# Altium schematic sheet Sheet1.SchDoc
size A4; SheetNumber: 1; SheetTotal: 1
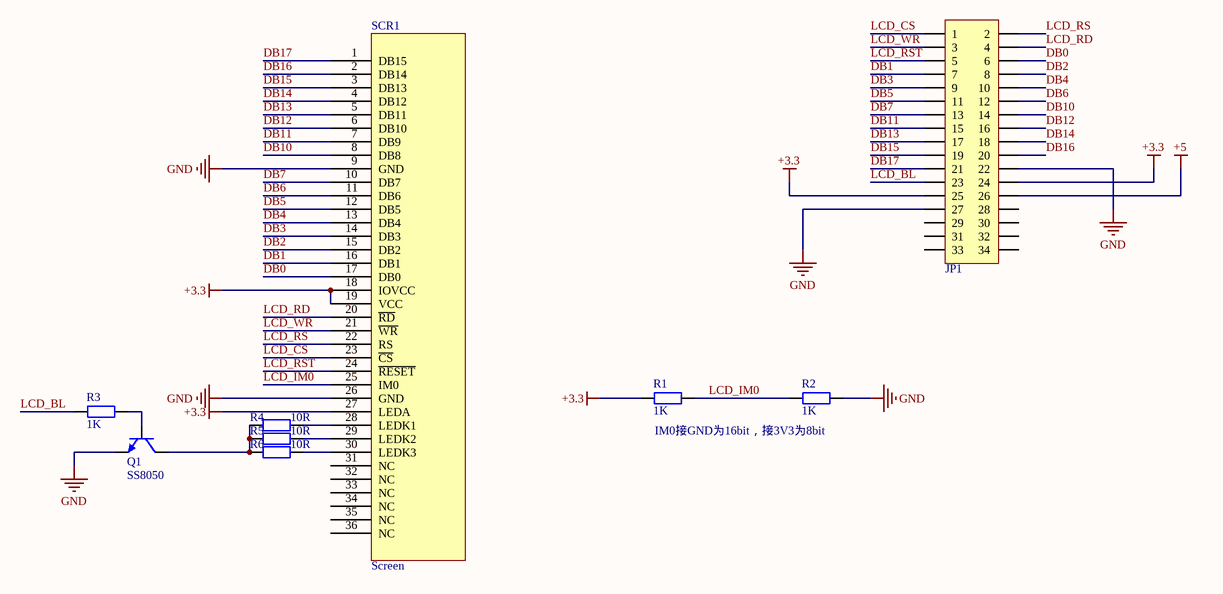
[diagram p0: Sheet1.SchDoc]

## Parts
JP1  Header 2X11  [HDR2.54-LI-2x17P]  (value not drawn)
Q1  SS8050  [SOT23-3N]
R1  1K  [R 0603_L]
R2  1K  [R 0603_L]
R3  1K  [R 0603_L]
R4  10R  [R 0603_L]
R5  10R  [R 0603_L]
R6  10R  [R 0603_L]
SCR1  Screen  [2.0inLCD]

## Nets
+3.3: JP1.24 JP1.25 R1.1 SCR1.18(IOVCC) SCR1.19(VCC) SCR1.27(LEDA)
+5: JP1.26
GND: JP1.22 JP1.27 Q1.2(E) R2.2 SCR1.9(GND) SCR1.26(GND)
DB0: JP1.6 SCR1.17(DB0)
DB1: JP1.7 SCR1.16(DB1)
DB2: JP1.8 SCR1.15(DB2)
DB3: JP1.9 SCR1.14(DB3)
DB4: JP1.10 SCR1.13(DB4)
DB5: JP1.11 SCR1.12(DB5)
DB6: JP1.12 SCR1.11(DB6)
DB7: JP1.13 SCR1.10(DB7)
DB10: JP1.14 SCR1.8(DB8)
DB11: JP1.15 SCR1.7(DB9)
DB12: JP1.16 SCR1.6(DB10)
DB13: JP1.17 SCR1.5(DB11)
DB14: JP1.18 SCR1.4(DB12)
DB15: JP1.19 SCR1.3(DB13)
DB16: JP1.20 SCR1.2(DB14)
DB17: JP1.21 SCR1.1(DB15)
LCD_BL: JP1.23 R3.1
LCD_CS: JP1.1 SCR1.23(~{CS})
LCD_IM0: R1.2 R2.1 SCR1.25(IM0)
LCD_RD: JP1.4 SCR1.20(~{RD})
LCD_RS: JP1.2 SCR1.22(RS)
LCD_RST: JP1.5 SCR1.24(~{RESET})
LCD_WR: JP1.3 SCR1.21(~{WR})
NetQ1_1: Q1.1(B) R3.2
NetQ1_3: Q1.3(C) R4.1 R5.1 R6.1
NetR4_2: R4.2 SCR1.28(LEDK1)
NetR5_2: R5.2 SCR1.29(LEDK2)
NetR6_2: R6.2 SCR1.30(LEDK3)

Not connected (* = marked no-connect by the designer): JP1 28 29 30 31 32 33 34; SCR1 31(NC) 32(NC) 33(NC) 34(NC) 35(NC) 36(NC)

## Notes on the sheet
- IM0接GND为16bit，接3V3为8bit

## Library data of the parts
JP1 = Header 17X2: 17*2P接插件; 封装库来自淘宝卖家  ID：黄晶宝石: 其他店铺购入均为盗版假冒封装库，请立即申请退款; 技术支持， 联系售后: 唯一出售店铺网址https://shop463601444.taobao.com; BOM名称: 17*2P接插件
Q1 = 8050-SMD: 高频放大-NPN型; 属性: 40V 1.5A 1W 100MHZ; 卖家免费技术支持，联系售后: 唯一出售店铺网址https://shop463601444.taobao.com; 封装库来自淘宝卖家 ID：黄晶宝石: 其他店铺购入均为假冒，请立即申请退款，本店奖励2~5元现金; BOM名称: 高频放大-NPN型; 卖家免费查找封装，联系售后: 唯一出售店铺网址https://shop463601444.taobao.com
R1-R6 = R: 贴片电阻; 优秀评价可免费更新: 联系淘宝ID：黄晶宝石，获取更新版封装库; 本封装库来自淘宝卖家 ID：黄晶宝石: 其他店铺购入均为盗版，请立即申请退款; 联系卖家，免费查找封装: 唯一出售店铺网址https://shop463601444.taobao.com; BOM名称: 贴片电阻
SCR1 = 2.0inLCD